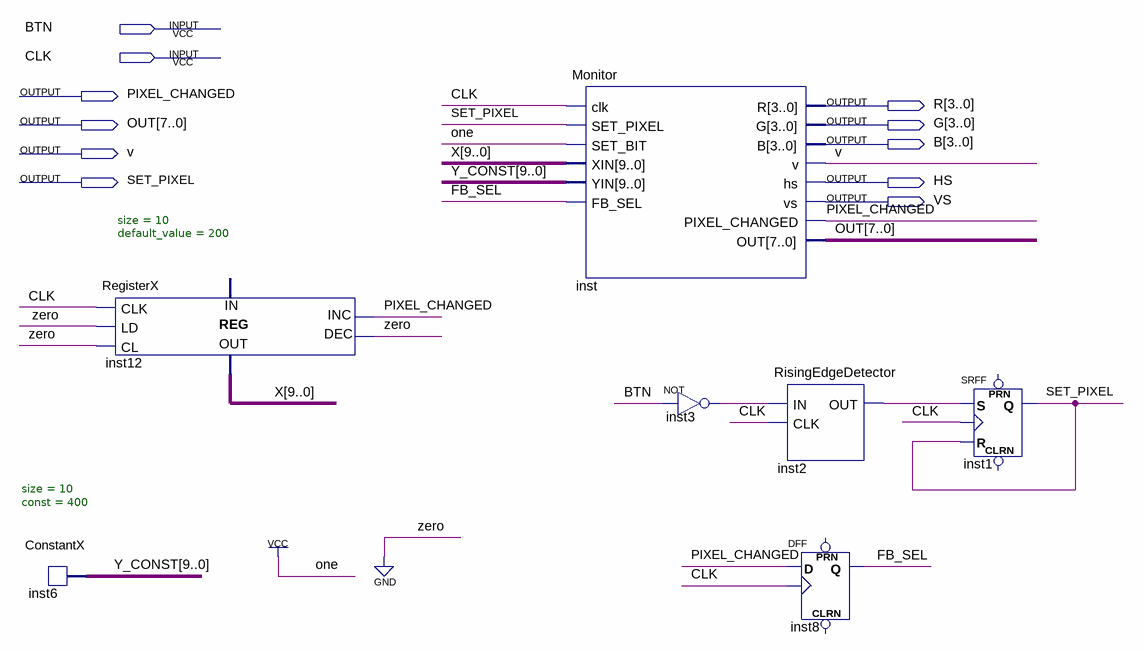
[diagram p0: schematic sheet]
// Quartus schematic VgaTest3.bdf as structural Verilog: 7 symbols, 11 pins
module VgaTest3 (
  input  BTN,
  input  CLK,
  output PIXEL_CHANGED,
  output [3:0] R,
  output [7:0] OUT,
  output [3:0] G,
  output [3:0] B,
  output v,
  output SET_PIXEL,
  output HS,
  output VS
);

  wire FB_SEL, inst2_out, inst3_out;
  wire [9:0] X, Y_CONST;

  ConstantX #(.size(10), .\const (400)) inst6 (.DATA_OUT(Y_CONST));
  RegisterX #(.size(10), .default_value(200)) inst12 (
    .CLK(CLK), .LD(1'b0), .CL(1'b0), .INC(PIXEL_CHANGED), .DEC(1'b0), .DATA_OUT(X));  // open: DATA_IN
  Monitor inst (
    .clk(CLK), .SET_PIXEL(SET_PIXEL), .SET_BIT(1'b1), .XIN(X), .YIN(Y_CONST), .FB_SEL(FB_SEL), .R(R), .G(G),
    .B(B), .v(v), .hs(HS), .vs(VS), .PIXEL_CHANGED(PIXEL_CHANGED), .OUT(OUT));
  not inst3 (inst3_out, BTN);
  RisingEdgeDetector inst2 (.IN(inst3_out), .CLK(CLK), .OUT(inst2_out));
  DFF inst8 (.CLK(CLK), .D(PIXEL_CHANGED), .Q(FB_SEL));  // open: CLRN, PRN
  SRFF inst1 (.S(inst2_out), .R(SET_PIXEL), .CLK(CLK), .Q(SET_PIXEL));  // open: PRN, CLRN
endmodule
